# EAGLE design Muzzle_Faster (EAGLE 9.6.0)
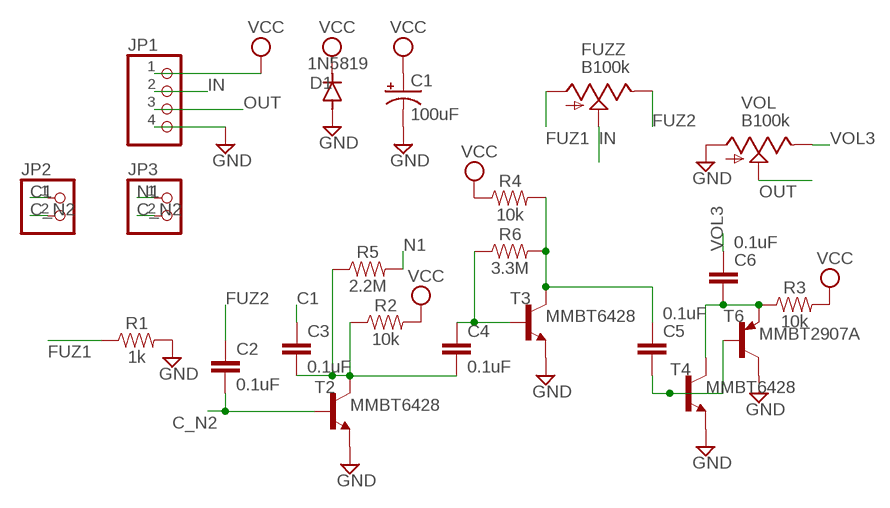
[diagram p0: schematic, sheet 1]

## Parts
C1  100uF  CAP_SMD+THRUPAN_B  [PAN_B_SMD+THRU]
C2  0.1uF  0.1UF-0603-25V-(+80/-20%)  [0603]
C3  0.1uF  0.1UF-0603-25V-(+80/-20%)  [0603]
C4  0.1uF  0.1UF-0603-25V-(+80/-20%)  [0603]
C5  0.1uF  0.1UF-0603-25V-(+80/-20%)  [0603]
C6  0.1uF  0.1UF-0603-25V-(+80/-20%)  [0603]
D1  1N5819  DIODE-SOD123  [SOD123]
FUZZ  B100k  9MM_SNAP-IN_POT_  [9MM_SNAP-IN_POT]
JP1  PINHD-1X4  [1X04]
JP2  PINHD-1X2  [1X02]
JP3  PINHD-1X2  [1X02]
R1  1k  1KOHM-0603-1/10W-1%  [0603]
R2  10k  10KOHM-0603-1/10W-1%  [0603]
R3  10k  10KOHM-0603-1/10W-1%  [0603]
R4  10k  10KOHM-0603-1/10W-1%  [0603]
R5  2.2M  RESISTOR0603  [0603]
R6  3.3M  RESISTOR0603  [0603]
T2  MMBT6428  BC817-16-NPN-SOT23-BEC  [SOT23-BEC]
T3  MMBT6428  BC817-16-NPN-SOT23-BEC  [SOT23-BEC]
T4  MMBT6428  BC817-16-NPN-SOT23-BEC  [SOT23-BEC]
T6  MMBT2907A  BC807-16-PNP-SOT23-BEC  [SOT23-BEC]
VOL  B100k  9MM_SNAP-IN_POT_  [9MM_SNAP-IN_POT]

## Nets
C1: C3.1 JP2.1
C_N2: C2.2 JP2.2 JP3.2 T2.B
FUZ1: FUZZ.1(A) R1.1
FUZ2: C2.1 FUZZ.3(E)
GND: C1.- C1.--(-) D1.A JP1.4 R1.2 T2.E T3.E T4.E T6.C VOL.1(A)
IN: FUZZ.2(S) JP1.2
N1: JP3.1 R5.2
N$1: C3.2 C4.2 R2.1 R5.1 T2.C
N$2: C4.1 R6.1 T3.B
N$3: C5.1 R4.2 R6.2 T3.C
N$4: C5.2 T4.B T6.B
N$5: C6.2 R3.1 T4.C T6.E
OUT: JP1.3 VOL.2(S)
VCC: C1.+ C1.++(+) D1.C JP1.1 R2.2 R3.2 R4.1
VOL3: C6.1 VOL.3(E)

## Library data of the parts
C1 = MusicThingModular:CAP_SMD+THRU
C2-C6 = SparkFun-Capacitors:0.1UF: 0.1µF ceramic capacitors A capacitor is a passive two-terminal electrical component used to store electrical energy temporarily in an electric field.; PROD_ID: CAP-00810
D1 = diode:DIODE-: DIODE
FUZZ VOL = MusicThingModular:9MM_SNAP-IN_POT: 9mm vertical snap-in pot, Alpha / Panasonic style
JP1 = Connector:PINHD-1X4: PIN HEADER; CATEGORY: CONNECTOR; SUB-CATEGORY: PIN-HEADER
JP2 JP3 = pinhead:PINHD-1X2: PIN HEADER
R1 = SparkFun-Resistors:1KOHM: 1kΩ resistor A resistor is a passive two-terminal electrical component that implements electrical resistance as a circuit element. Resistors act to reduce current flow, and, at the same time, act to lower voltage levels within circuits. - Wikipedia; PROD_ID: RES-07856
R2-R4 = SparkFun-Resistors:10KOHM: 10kΩ resistor A resistor is a passive two-terminal electrical component that implements electrical resistance as a circuit element. Resistors act to reduce current flow, and, at the same time, act to lower voltage levels within circuits. - Wikipedia; PROD_ID: RES-00824
R5 R6 = SparkFun-Resistors:RESISTOR: Generic Resistor Package
T2-T4 = MusicThingModular:*-NPN-: NPN Transistror BF959 corrected 2008.03.06
T6 = MusicThingModular:*-PNP-: PNP Transistror

## Board
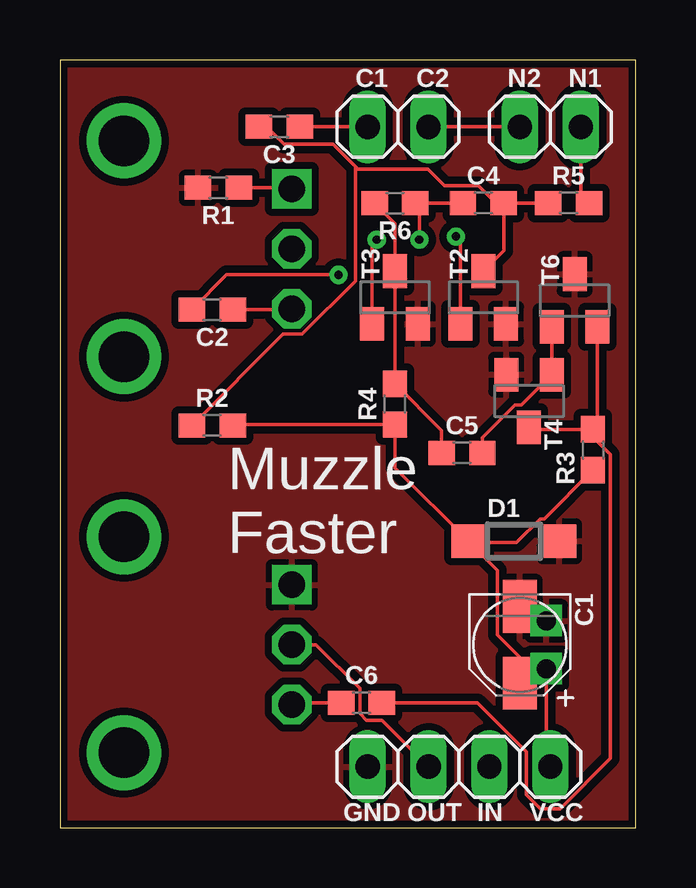
[diagram p1: board, top side]
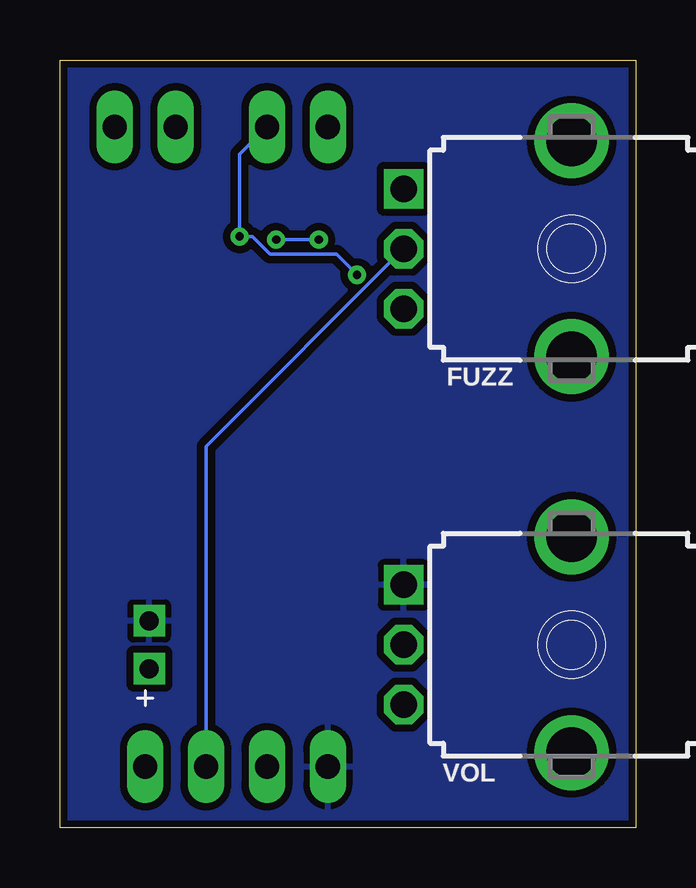
[diagram p2: board, bottom side, seen from below]

Size 24 x 32 mm. Coordinates in mm from the lower left corner, seen from the top.
Outline: 0,0 24,0 24,32 0,32 0,0
Copper layers (1*16): Top 0.035mm / dielectric 1.5mm / Bottom 0.035mm
Design rules "default *": minimum track width 6mil, minimum drill 0.35mm, track to track 6mil, track to pad 6mil, pad to pad 6mil, via to via 6mil, smd to smd 6mil, copper to edge 6mil, drill to drill 6mil, minimum pad ring 10mil, minimum via ring 8mil, stop-mask expansion 4mil, vias tented up to drill 0mil, thermal gap 10mil

### Footprints (pad centres in the part's own frame; a part is rotated, then mirrored left to right if it is on the bottom)
PAN_B_SMD+THRU = smd 2.2 x 1.4: + 1.6,0; - -1.6,0 | drill 0.8 pad 0.9 square: ++ 1,1.1; -- -1,1.1
0603 = smd 1.1 x 1: 1 -0.85,0; 2 0.85,0
SOD123 = smd 1.4 x 1.4: A 1.9,0; C -1.9,0
9MM_SNAP-IN_POT = drill 1.1 square: 1 -2.5,-7 | drill 1.1 octagon: 2 0,-7; 3 2.5,-7 | drill 2.1 pad 2.794: CHASSIS1 -4.5,0; CHASSIS2 4.5,0
1X04 = drill 1.016 long: 1 -3.81,0; 2 -1.27,0; 3 1.27,0; 4 3.81,0
1X02 = drill 1.016 long: 1 -1.27,0; 2 1.27,0
SOT23-BEC = smd 1 x 1.4: B -0.95,-1.1; C 0,1.1; E 0.95,-1.1

### Placement (x,y rotation side)
C1  19.18,7.62 270 top
C2  6.35,21.59 180 top
C3  9.14,29.21 180 top
C4  17.65,26.04 0 top
C5  16.76,15.62 0 top
C6  12.57,5.21 0 top
D1  18.92,11.94 0 top
FUZZ  2.67,24.13 270 bottom
JP1  16.64,2.54 180 top
JP2  14.1,29.21 0 top
JP3  20.45,29.21 180 top
R1  6.6,26.67 180 top
R2  6.35,16.76 0 top
R3  22.23,15.75 270 top
R4  13.97,17.65 90 top
R5  21.21,26.04 0 top
R6  13.97,26.04 180 top
T2  17.65,22.1 0 top
T3  13.97,22.1 0 top
T4  19.56,17.78 180 top
T6  21.46,21.97 0 top
VOL  2.67,7.62 270 bottom

### Tracks (layer width: path | path; a pad name or v marks a point on that pad's centre or on a via)
C1
  Top 0.152: JP2.1 C3.1
C_N2  (via drill 0.35)
  Top 0.152: JP3.2 JP2.2 | T2.B 16.7,24.45 v16.51,24.64 | C2.2 6.95,23.04 v11.61,23.04
  Bottom 0.152: JP2.2 16.51,28.07 v16.51,24.64 15.97,24.64 15.24,23.9 12.47,23.9 v11.61,23.04
FUZ1
  Top 0.152: R1.1 9.63,26.67 FUZZ.1
FUZ2
  Top 0.152: C2.1 9.63,21.59 FUZZ.3
GND
  pour Top (isolate 0.305): -0.64,32.38 -0.64,0.13 0.13,-0.64 25.27,-0.64 25.27,31.75 23.88,33.15 0.13,33.15
  pour Bottom (isolate 0.305): -0.38,32.77 -0.38,-0.13 0.25,-0.76 24,-0.76 25.27,0.51 25.27,31.37 23.5,33.15 0.13,33.15
IN
  Bottom 0.152: FUZZ.2 17.91,15.89 JP1.2
N1
  Top 0.152: R5.2 21.72,26.38 JP3.1
N$1
  Top 0.152: C4.2 18.5,24.05 T2.C | C4.2 R5.1 | C3.2 8.62,29.21 9.35,28.48 11.39,28.48 12.32,27.56 | 12.32,27.56 12.42,27.46 15.34,27.46 16.04,26.76 17.45,26.76 18.18,26.04 C4.2 | R2.1 9.31,20.58 10.1,20.58 12.32,22.79 12.32,27.56
N$2  (via drill 0.35)
  Top 0.152: R6.1 14.99,26.04 | 14.99,26.04 C4.1 | T3.B 13.02,24.32 v13.21,24.51 | v14.99,24.51 14.99,26.04
  Bottom 0.152: v13.21,24.51 v14.99,24.51
N$3
  Top 0.152: R6.2 13.97,25.18 T3.C R4.2 15.91,16.56 C5.1
N$4
  Top 0.152: T6.B T4.B 19.24,17.61 18.96,17.61 17.61,16.26 C5.2
N$5
  Top 0.152: R3.1 19.64,16.6 T4.C | T6.E 22.41,16.79 R3.1 | R3.1 22.23,16.27 22.95,15.54 22.95,2.88 20.86,0.79 20.04,0.79 19.46,1.37 19.46,3.15 17.4,5.21 C6.2
OUT
  Top 0.152: JP1.3 13.43,4.48 12.78,4.48 12.5,4.75 12.5,5.8 10.68,7.62 VOL.2
VCC
  Top 0.152: JP1.1 20.28,2.71 C1.++ 19.68,6.02 19.3,6.02 | 19.3,6.02 C1.+ | 17.08,11.88 D1.C 13.97,14.99 R4.1 7.24,16.8 R2.2 | 17.08,11.88 18.25,10.71 18.25,8.03 19.3,6.97 19.3,6.02 | R3.2 20.19,12.87 20.03,12.87 19.04,11.88 17.08,11.88
VOL3
  Top 0.152: VOL.3 9.75,5.21 C6.1

### Text on the board
tPlace: C1 | C2 | N2 | N1 | Muzzle / Faster | GND | OUT | IN | VCC